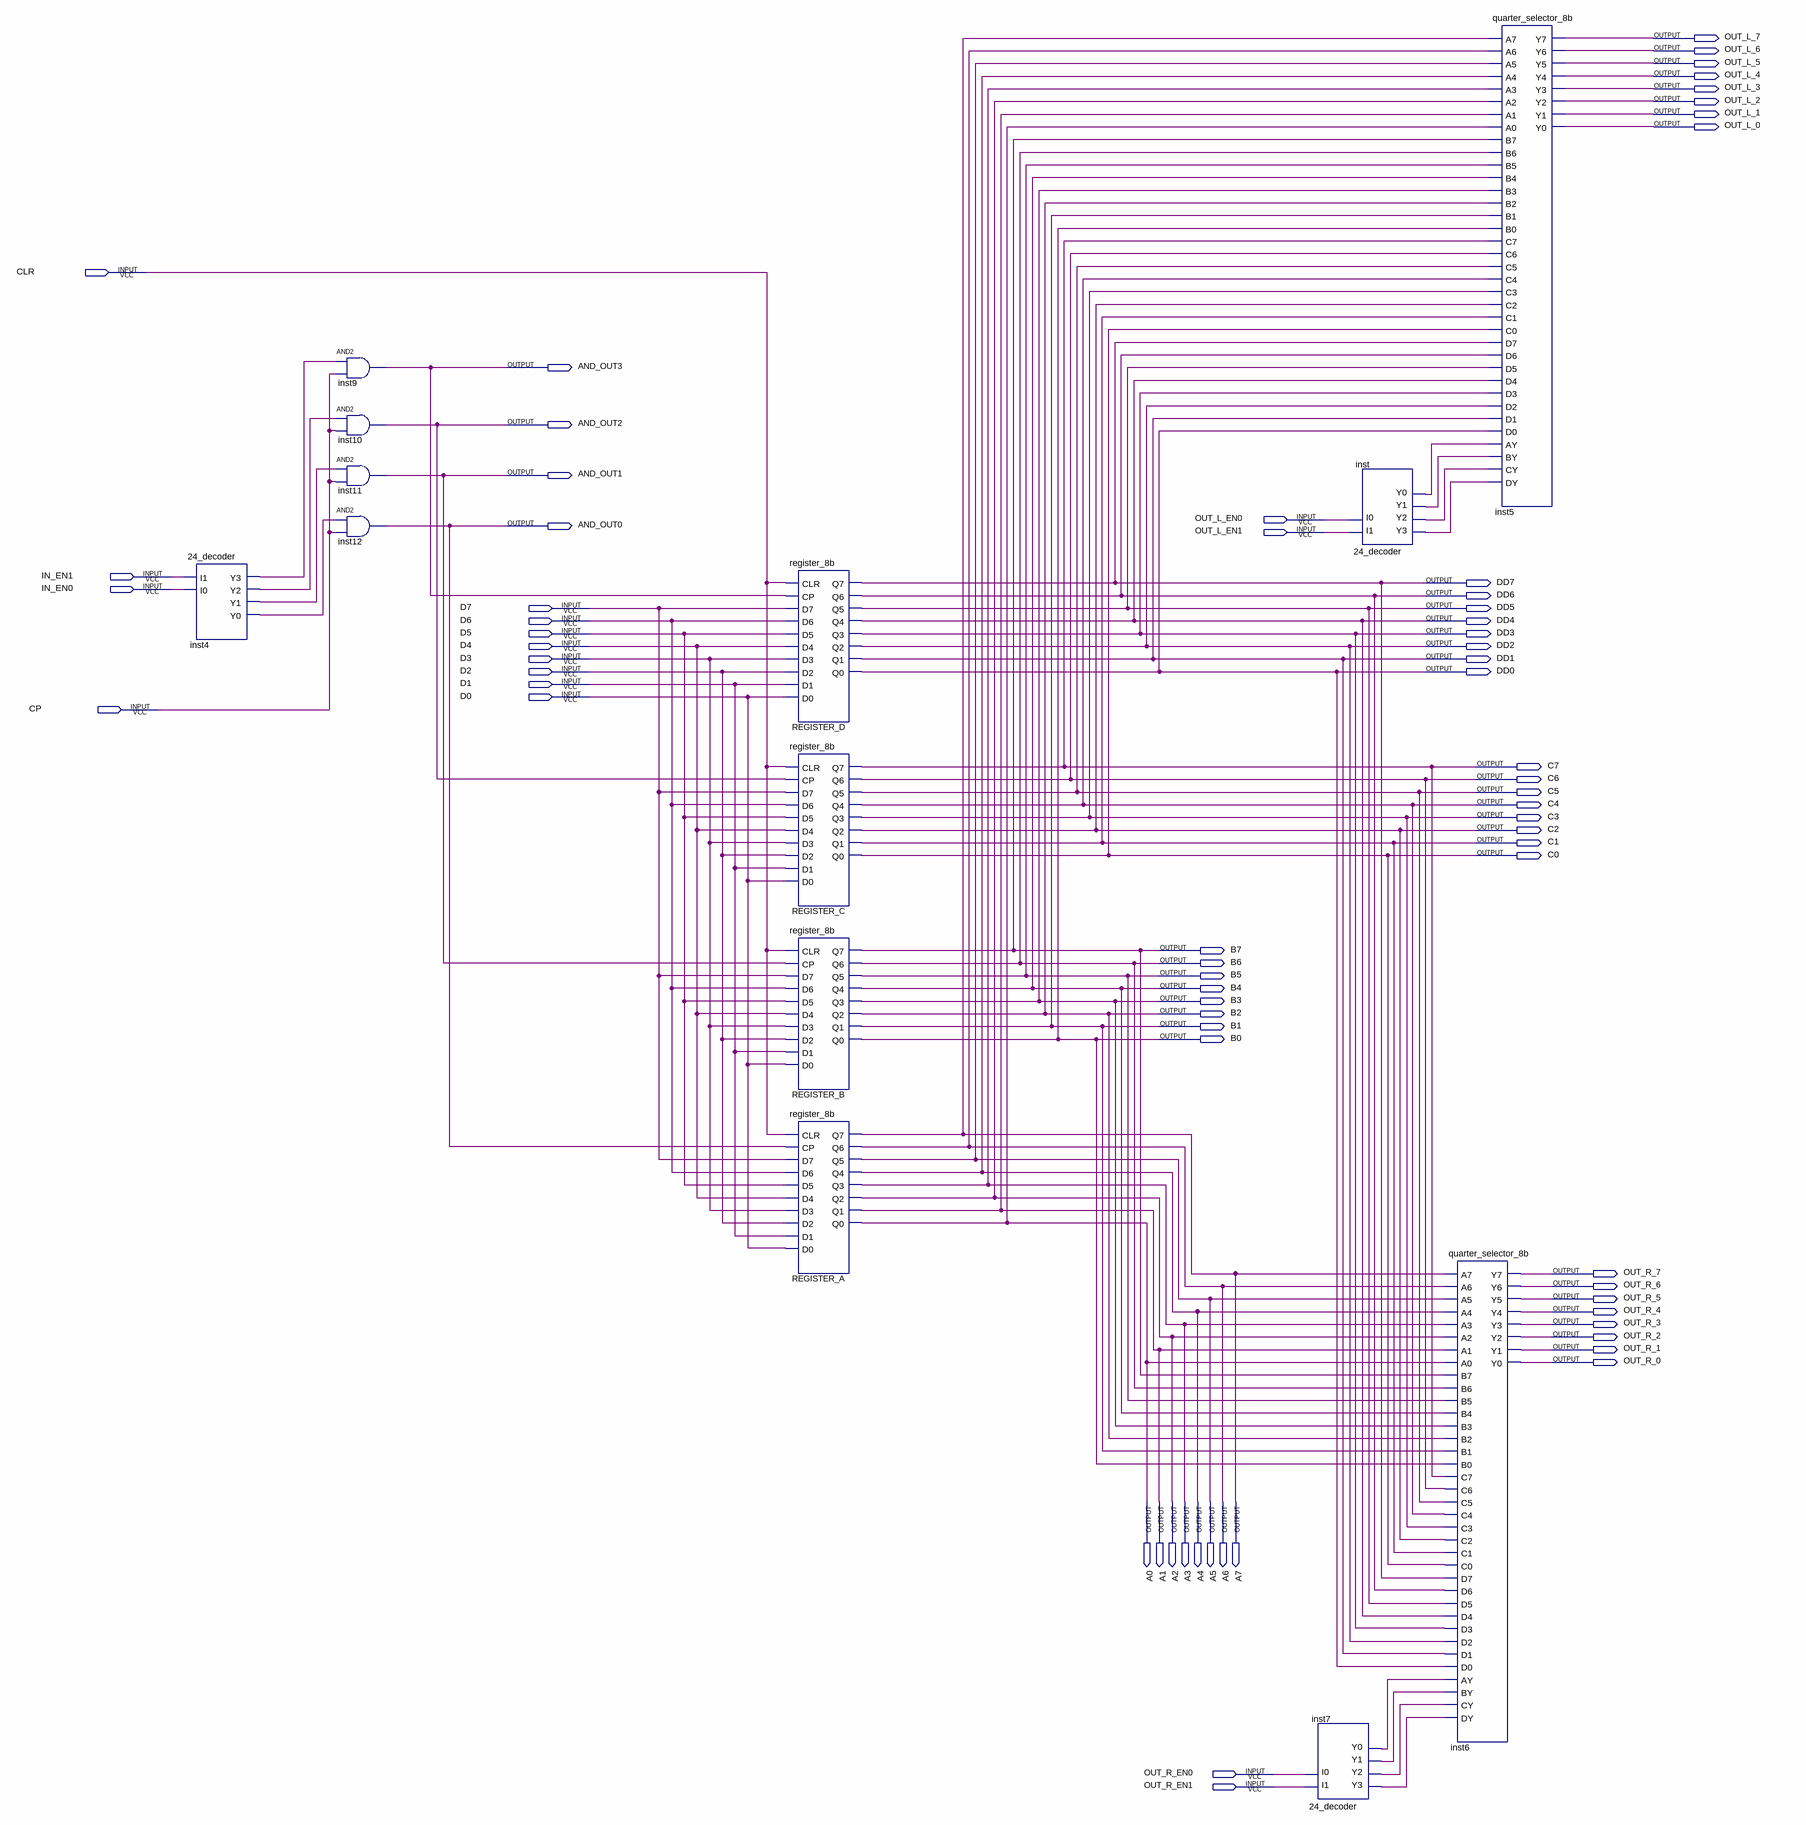
[diagram p0: schematic sheet]
// Quartus schematic test_register_group.bdf as structural Verilog: 13 symbols, 68 pins
module test_register_group (
  input  CLR,
  input  OUT_L_EN0,
  input  OUT_L_EN1,
  input  IN_EN1,
  input  IN_EN0,
  input  D7,
  input  D6,
  input  D5,
  input  D4,
  input  D3,
  input  D2,
  input  D1,
  input  D0,
  input  CP,
  input  OUT_R_EN0,
  input  OUT_R_EN1,
  output OUT_L_7,
  output OUT_L_6,
  output OUT_L_5,
  output OUT_L_4,
  output OUT_L_3,
  output OUT_L_2,
  output OUT_L_1,
  output OUT_L_0,
  output AND_OUT3,
  output AND_OUT2,
  output AND_OUT1,
  output AND_OUT0,
  output DD7,
  output DD6,
  output DD5,
  output DD4,
  output DD3,
  output DD2,
  output DD1,
  output DD0,
  output C7,
  output C6,
  output C5,
  output C4,
  output C3,
  output C2,
  output C1,
  output C0,
  output B7,
  output B6,
  output B5,
  output B4,
  output B3,
  output B2,
  output B1,
  output B0,
  output OUT_R_7,
  output OUT_R_6,
  output OUT_R_5,
  output OUT_R_4,
  output OUT_R_3,
  output OUT_R_2,
  output OUT_R_1,
  output OUT_R_0,
  output A0,
  output A1,
  output A2,
  output A3,
  output A4,
  output A5,
  output A6,
  output A7
);

  wire inst4_y0, inst4_y1, inst4_y2, inst4_y3, inst7_y0, inst7_y1, inst7_y2, inst7_y3, inst_y0, inst_y1,
       inst_y2, inst_y3;

  \24_decoder  inst4 (.I1(IN_EN1), .I0(IN_EN0), .Y3(inst4_y3), .Y2(inst4_y2), .Y1(inst4_y1), .Y0(inst4_y0));
  and inst9 (AND_OUT3, inst4_y3, CP);
  and inst10 (AND_OUT2, inst4_y2, CP);
  and inst11 (AND_OUT1, inst4_y1, CP);
  and inst12 (AND_OUT0, inst4_y0, CP);
  register_8b REGISTER_D (
    .CLR(CLR), .CP(AND_OUT3), .D7(D7), .D6(D6), .D5(D5), .D4(D4), .D3(D3), .D2(D2), .D1(D1), .D0(D0),
    .Q7(DD7), .Q6(DD6), .Q5(DD5), .Q4(DD4), .Q3(DD3), .Q2(DD2), .Q1(DD1), .Q0(DD0));
  register_8b REGISTER_C (
    .CLR(CLR), .CP(AND_OUT2), .D7(D7), .D6(D6), .D5(D5), .D4(D4), .D3(D3), .D2(D2), .D1(D1), .D0(D0),
    .Q7(C7), .Q6(C6), .Q5(C5), .Q4(C4), .Q3(C3), .Q2(C2), .Q1(C1), .Q0(C0));
  register_8b REGISTER_B (
    .CLR(CLR), .CP(AND_OUT1), .D7(D7), .D6(D6), .D5(D5), .D4(D4), .D3(D3), .D2(D2), .D1(D1), .D0(D0),
    .Q7(B7), .Q6(B6), .Q5(B5), .Q4(B4), .Q3(B3), .Q2(B2), .Q1(B1), .Q0(B0));
  register_8b REGISTER_A (
    .CLR(CLR), .CP(AND_OUT0), .D7(D7), .D6(D6), .D5(D5), .D4(D4), .D3(D3), .D2(D2), .D1(D1), .D0(D0),
    .Q7(A7), .Q6(A6), .Q5(A5), .Q4(A4), .Q3(A3), .Q2(A2), .Q1(A1), .Q0(A0));
  \24_decoder  inst (.I1(OUT_L_EN1), .I0(OUT_L_EN0), .Y3(inst_y3), .Y2(inst_y2), .Y1(inst_y1), .Y0(inst_y0));
  \24_decoder  inst7 (.I1(OUT_R_EN1), .I0(OUT_R_EN0), .Y3(inst7_y3), .Y2(inst7_y2), .Y1(inst7_y1), .Y0(inst7_y0));
  quarter_selector_8b inst6 (
    .A7(A7), .A6(A6), .A5(A5), .A4(A4), .A3(A3), .A2(A2), .A1(A1), .A0(A0), .B7(B7), .B6(B6), .B5(B5),
    .B4(B4), .B3(B3), .B2(B2), .B1(B1), .B0(B0), .AY(inst7_y0), .BY(inst7_y1), .C7(C7), .C6(C6), .C5(C5),
    .C4(C4), .C3(C3), .C2(C2), .C1(C1), .C0(C0), .D7(DD7), .D6(DD6), .D5(DD5), .D4(DD4), .D3(DD3), .D2(DD2),
    .D1(DD1), .D0(DD0), .CY(inst7_y2), .DY(inst7_y3), .Y7(OUT_R_7), .Y6(OUT_R_6), .Y5(OUT_R_5), .Y4(OUT_R_4),
    .Y3(OUT_R_3), .Y2(OUT_R_2), .Y1(OUT_R_1), .Y0(OUT_R_0));
  quarter_selector_8b inst5 (
    .A7(A7), .A6(A6), .A5(A5), .A4(A4), .A3(A3), .A2(A2), .A1(A1), .A0(A0), .B7(B7), .B6(B6), .B5(B5),
    .B4(B4), .B3(B3), .B2(B2), .B1(B1), .B0(B0), .AY(inst_y0), .BY(inst_y1), .C7(C7), .C6(C6), .C5(C5),
    .C4(C4), .C3(C3), .C2(C2), .C1(C1), .C0(C0), .D7(DD7), .D6(DD6), .D5(DD5), .D4(DD4), .D3(DD3), .D2(DD2),
    .D1(DD1), .D0(DD0), .CY(inst_y2), .DY(inst_y3), .Y7(OUT_L_7), .Y6(OUT_L_6), .Y5(OUT_L_5), .Y4(OUT_L_4),
    .Y3(OUT_L_3), .Y2(OUT_L_2), .Y1(OUT_L_1), .Y0(OUT_L_0));
endmodule
